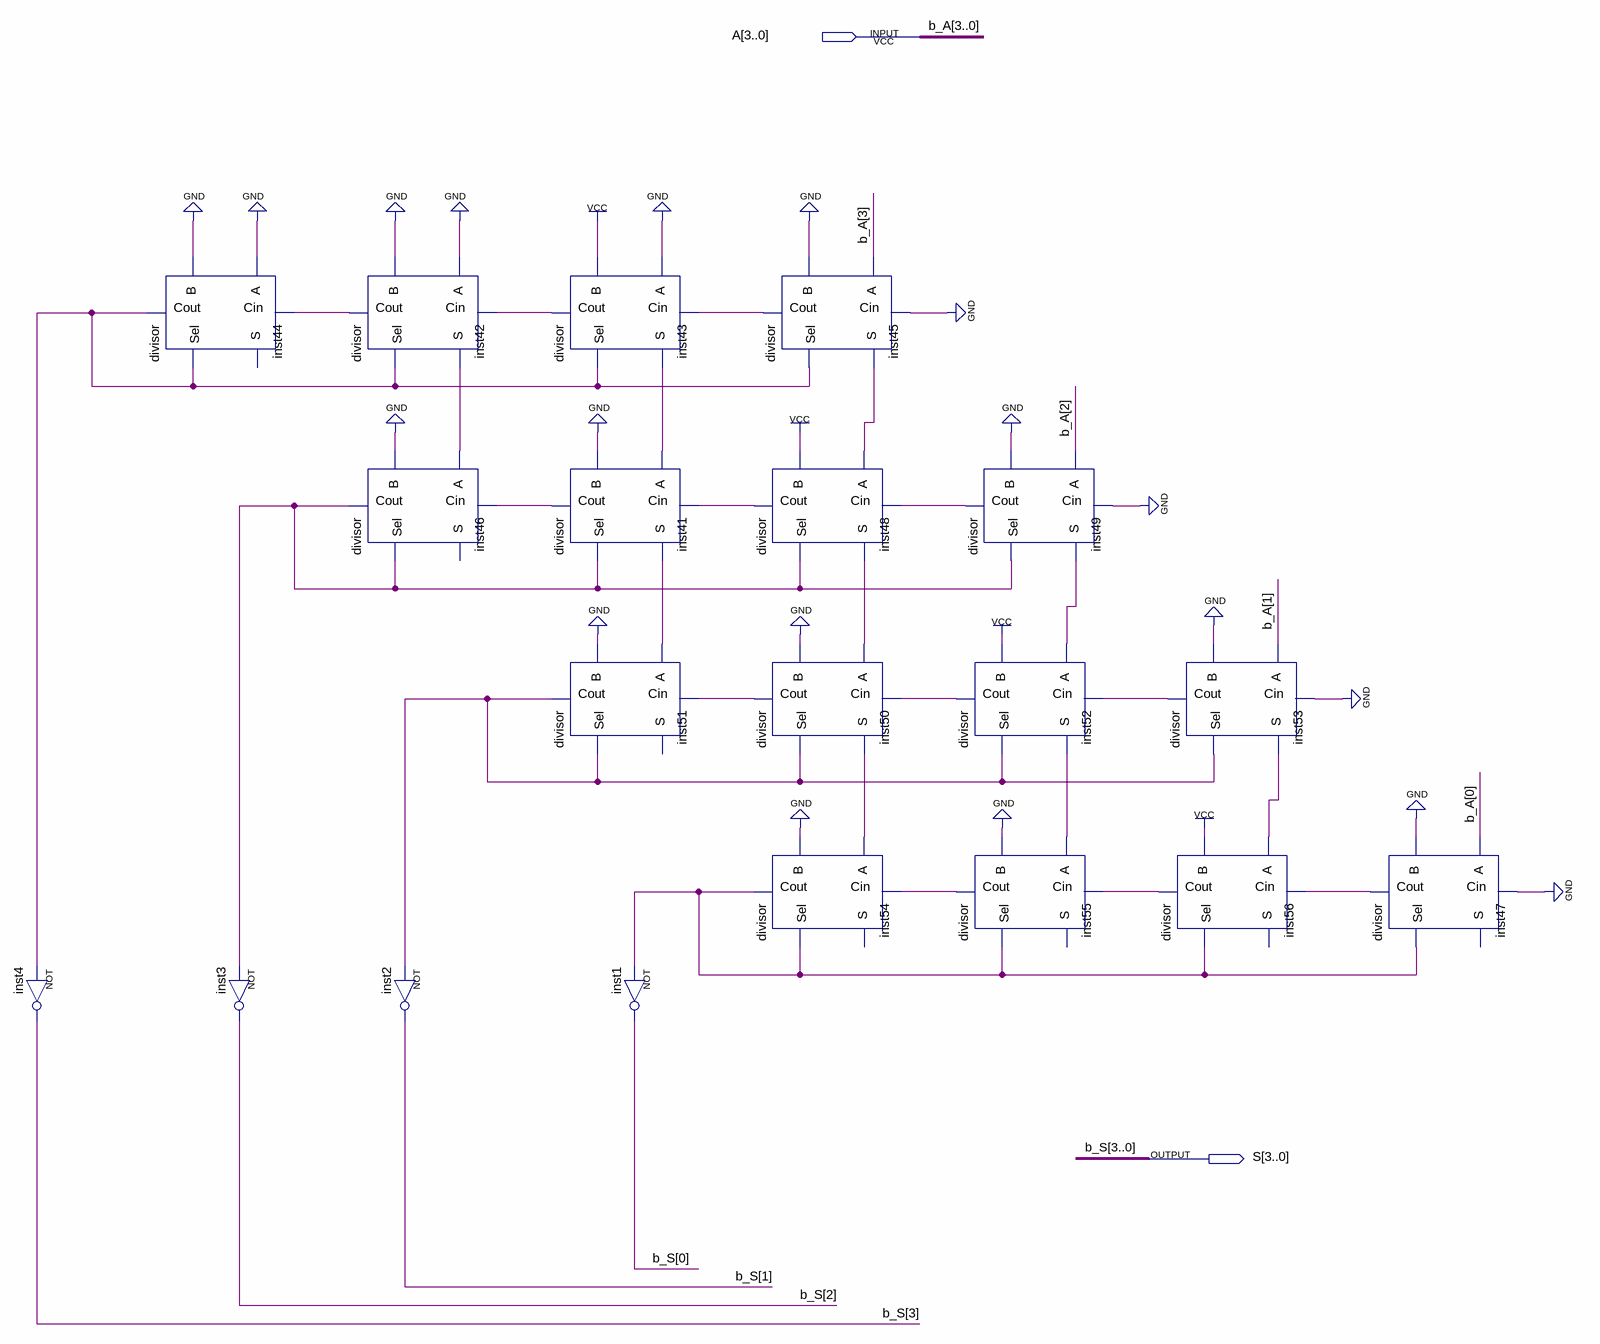
[diagram p0: schematic sheet]
// Quartus schematic divisao.bdf as structural Verilog: 20 symbols, 2 pins
module divisao (
  input  [3:0] A,
  output [3:0] S
);

  wire inst41_cout, inst41_s, inst42_cout, inst42_s, inst43_cout, inst43_s, inst44_cout, inst45_cout,
       inst45_s, inst46_cout, inst47_cout, inst48_cout, inst48_s, inst49_cout, inst49_s, inst50_cout,
       inst50_s, inst51_cout, inst52_cout, inst52_s, inst53_cout, inst53_s, inst54_cout, inst55_cout,
       inst56_cout;

  not inst4 (S[3], inst44_cout);
  divisor inst44 (.A(1'b0), .B(1'b0), .Cin(inst42_cout), .Sel(inst44_cout), .Cout(inst44_cout));  // open: S
  not inst3 (S[2], inst46_cout);
  divisor inst42 (.A(1'b0), .B(1'b0), .Cin(inst43_cout), .Sel(inst44_cout), .S(inst42_s), .Cout(inst42_cout));
  divisor inst46 (.A(inst42_s), .B(1'b0), .Cin(inst41_cout), .Sel(inst46_cout), .Cout(inst46_cout));  // open: S
  not inst2 (S[1], inst51_cout);
  divisor inst43 (.A(1'b0), .B(1'b1), .Cin(inst45_cout), .Sel(inst44_cout), .S(inst43_s), .Cout(inst43_cout));
  divisor inst41 (.A(inst43_s), .B(1'b0), .Cin(inst48_cout), .Sel(inst46_cout), .S(inst41_s), .Cout(inst41_cout));
  divisor inst51 (.A(inst41_s), .B(1'b0), .Cin(inst50_cout), .Sel(inst51_cout), .Cout(inst51_cout));  // open: S
  not inst1 (S[0], inst54_cout);
  divisor inst45 (.A(A[3]), .B(1'b0), .Cin(1'b0), .Sel(inst44_cout), .S(inst45_s), .Cout(inst45_cout));
  divisor inst48 (.A(inst45_s), .B(1'b1), .Cin(inst49_cout), .Sel(inst46_cout), .S(inst48_s), .Cout(inst48_cout));
  divisor inst50 (.A(inst48_s), .B(1'b0), .Cin(inst52_cout), .Sel(inst51_cout), .S(inst50_s), .Cout(inst50_cout));
  divisor inst54 (.A(inst50_s), .B(1'b0), .Cin(inst55_cout), .Sel(inst54_cout), .Cout(inst54_cout));  // open: S
  divisor inst49 (.A(A[2]), .B(1'b0), .Cin(1'b0), .Sel(inst46_cout), .S(inst49_s), .Cout(inst49_cout));
  divisor inst52 (.A(inst49_s), .B(1'b1), .Cin(inst53_cout), .Sel(inst51_cout), .S(inst52_s), .Cout(inst52_cout));
  divisor inst55 (.A(inst52_s), .B(1'b0), .Cin(inst56_cout), .Sel(inst54_cout), .Cout(inst55_cout));  // open: S
  divisor inst53 (.A(A[1]), .B(1'b0), .Cin(1'b0), .Sel(inst51_cout), .S(inst53_s), .Cout(inst53_cout));
  divisor inst56 (.A(inst53_s), .B(1'b1), .Cin(inst47_cout), .Sel(inst54_cout), .Cout(inst56_cout));  // open: S
  divisor inst47 (.A(A[0]), .B(1'b0), .Cin(1'b0), .Sel(inst54_cout), .Cout(inst47_cout));  // open: S

  // Other names for the same wires on the sheet: b_A[3:0] = A; b_S[3:0] = S
endmodule
